# EasyEDA Pro project 3_circuito logico AND.eprj

# Schematic Schematic1

## Sheets
1 P1: Board Name: Board1; Create Date: 2025-03-28; Page Name: P1; Project Name: 3_circuito logico AND; Schematic Name: Schematic1; Update Date: 2025-03-28
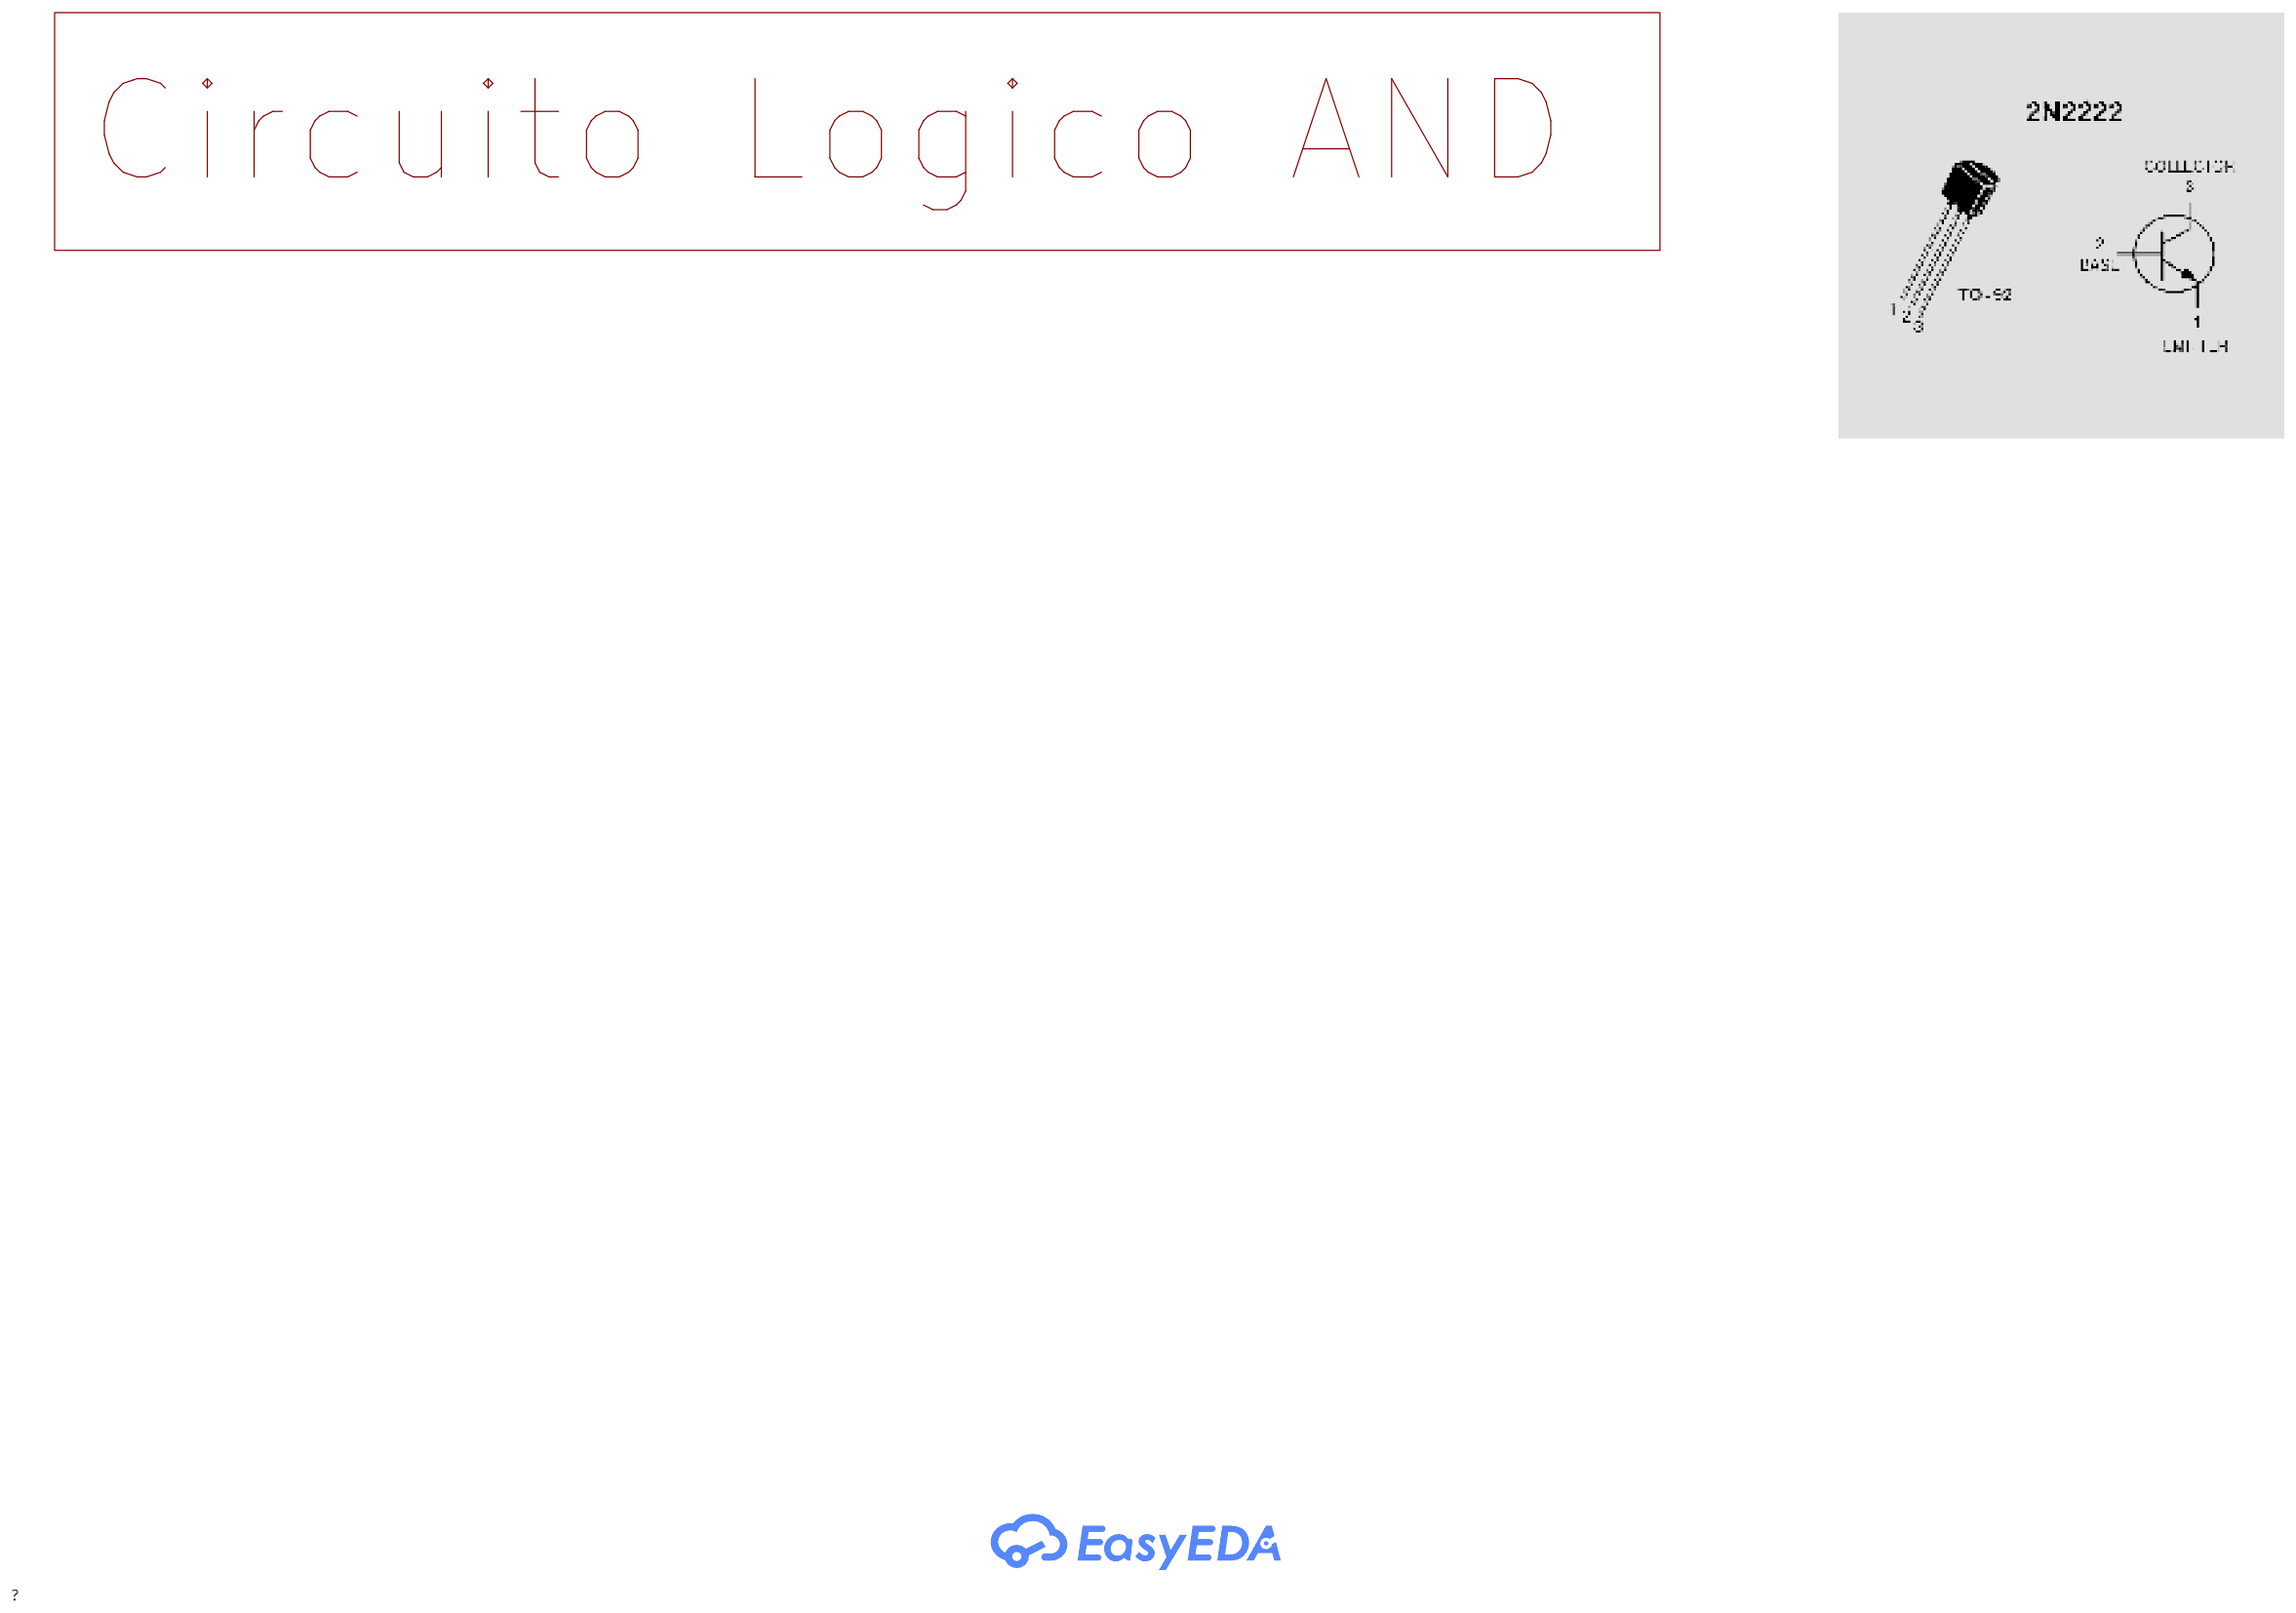
[diagram p0: P1]
2 P2: Page Name: P2
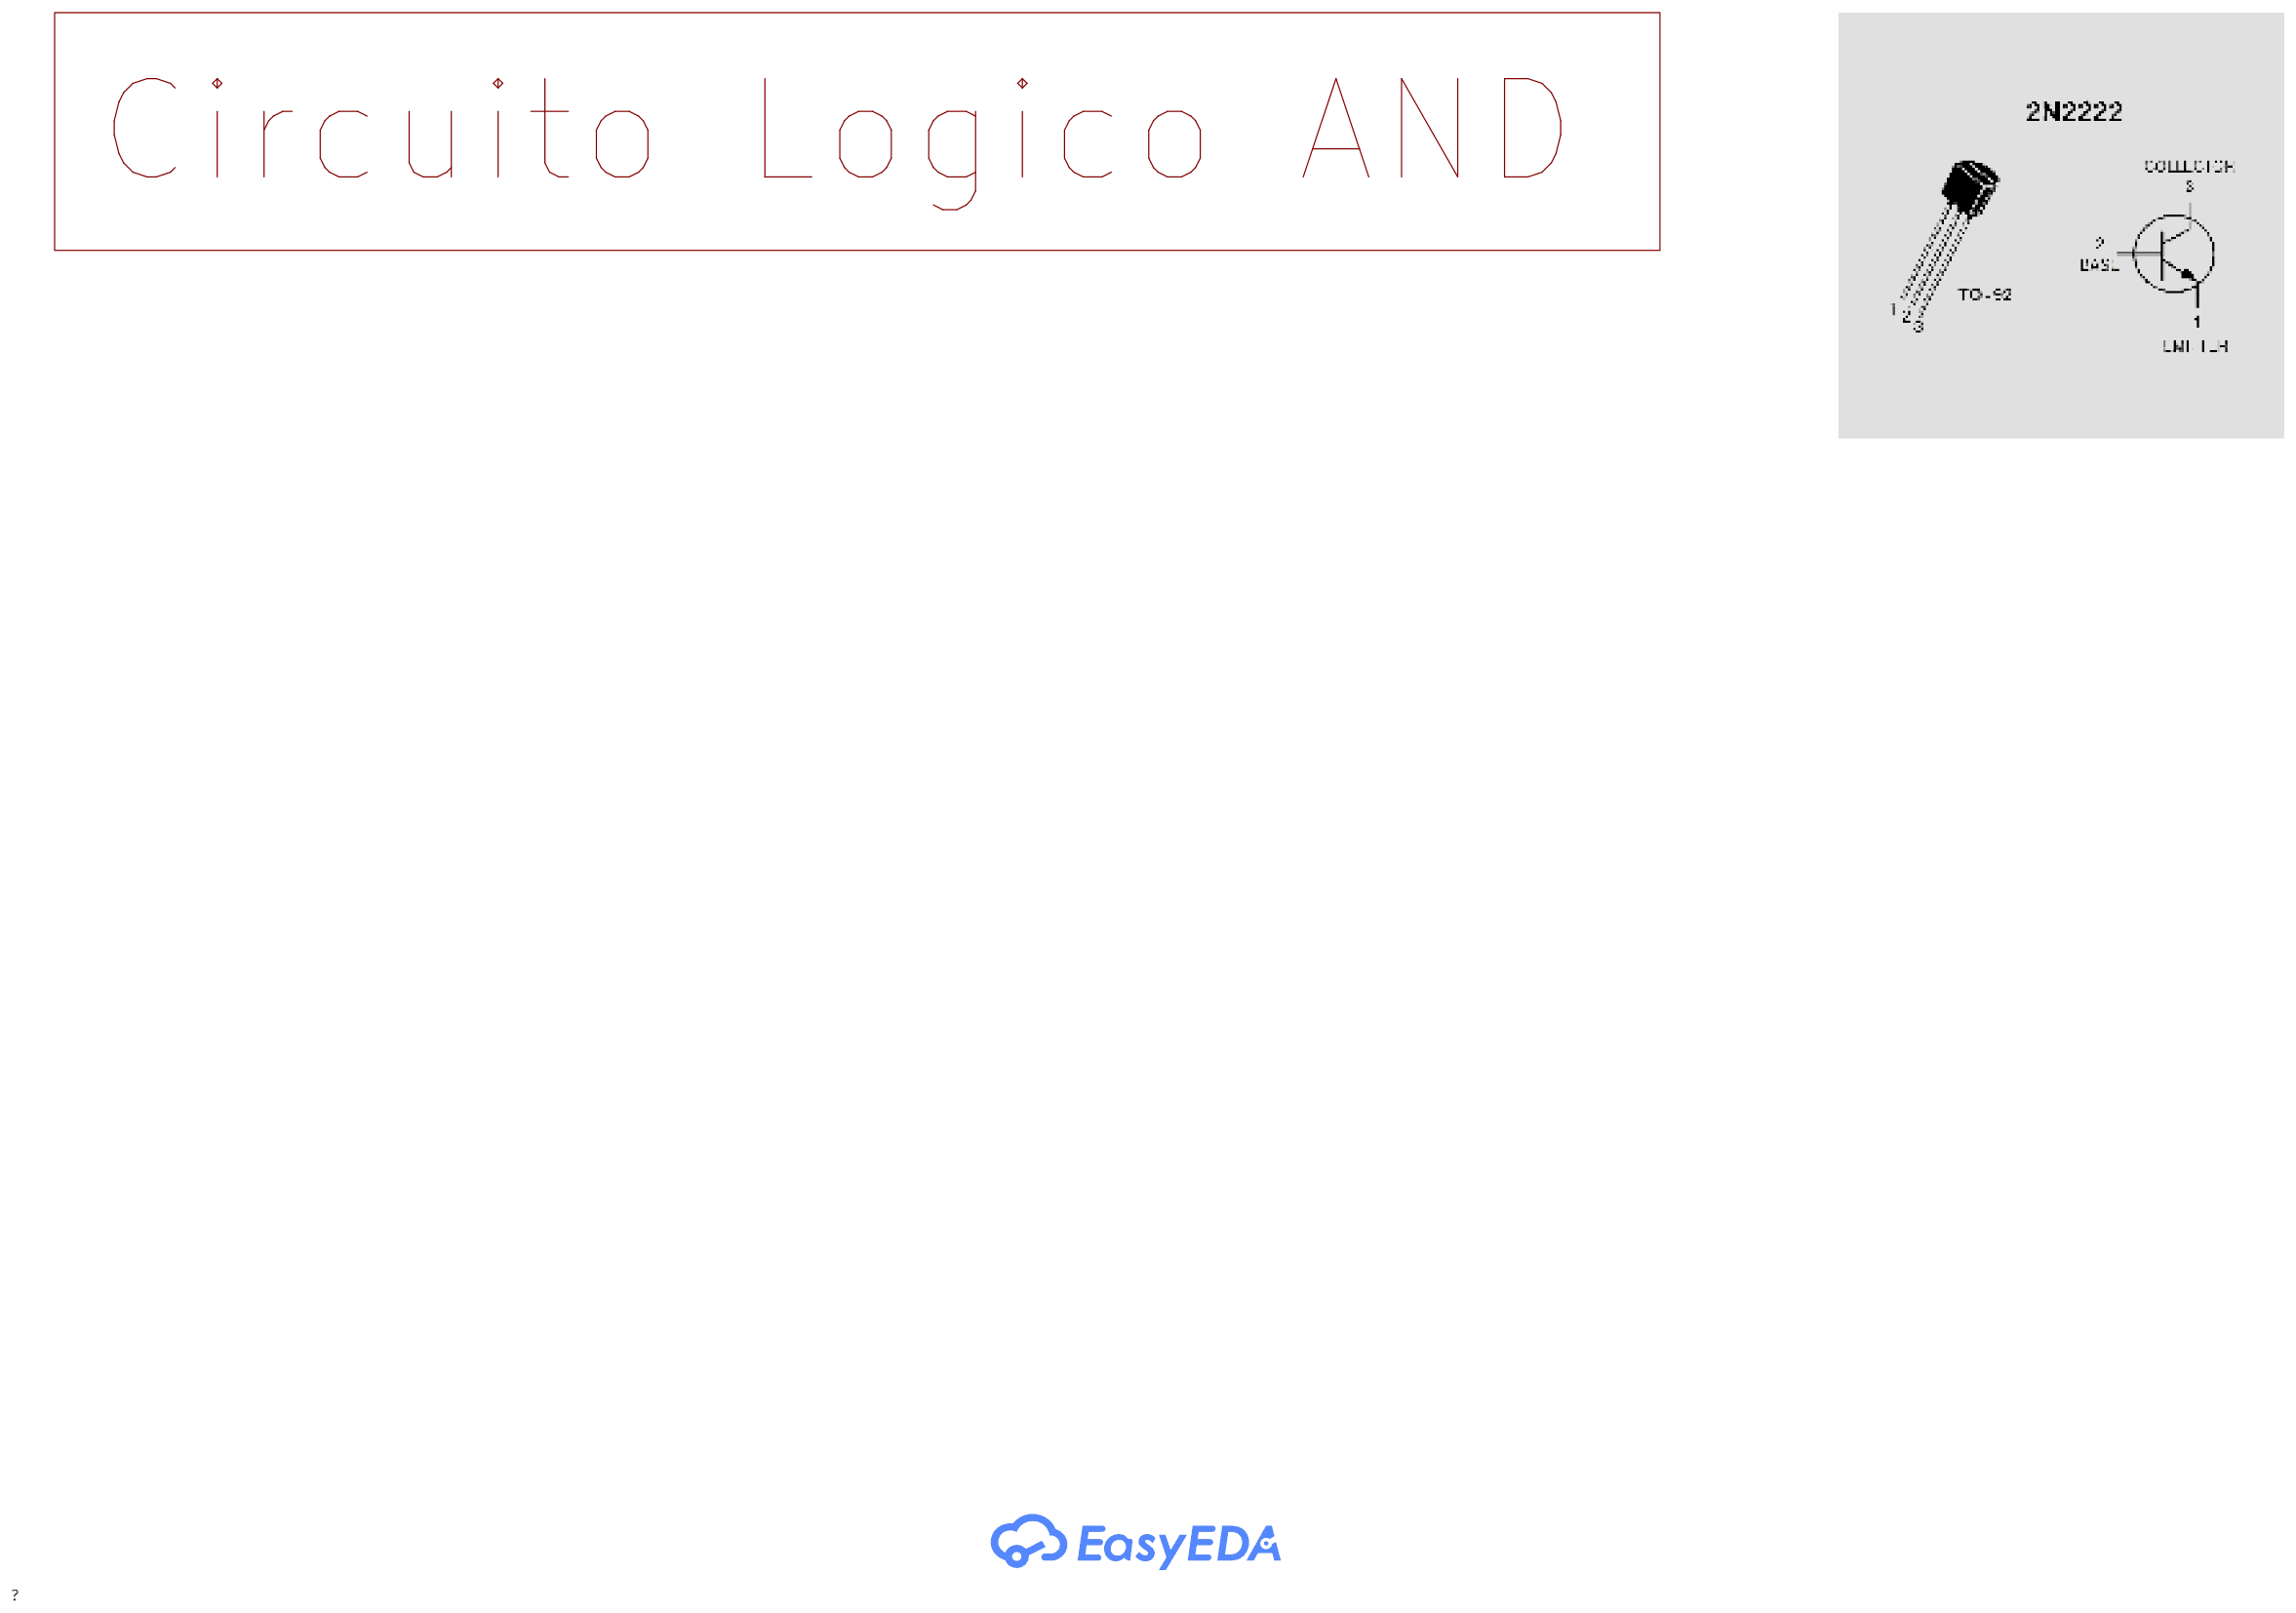
[diagram p1: P2]
3 P3: Page Name: P3
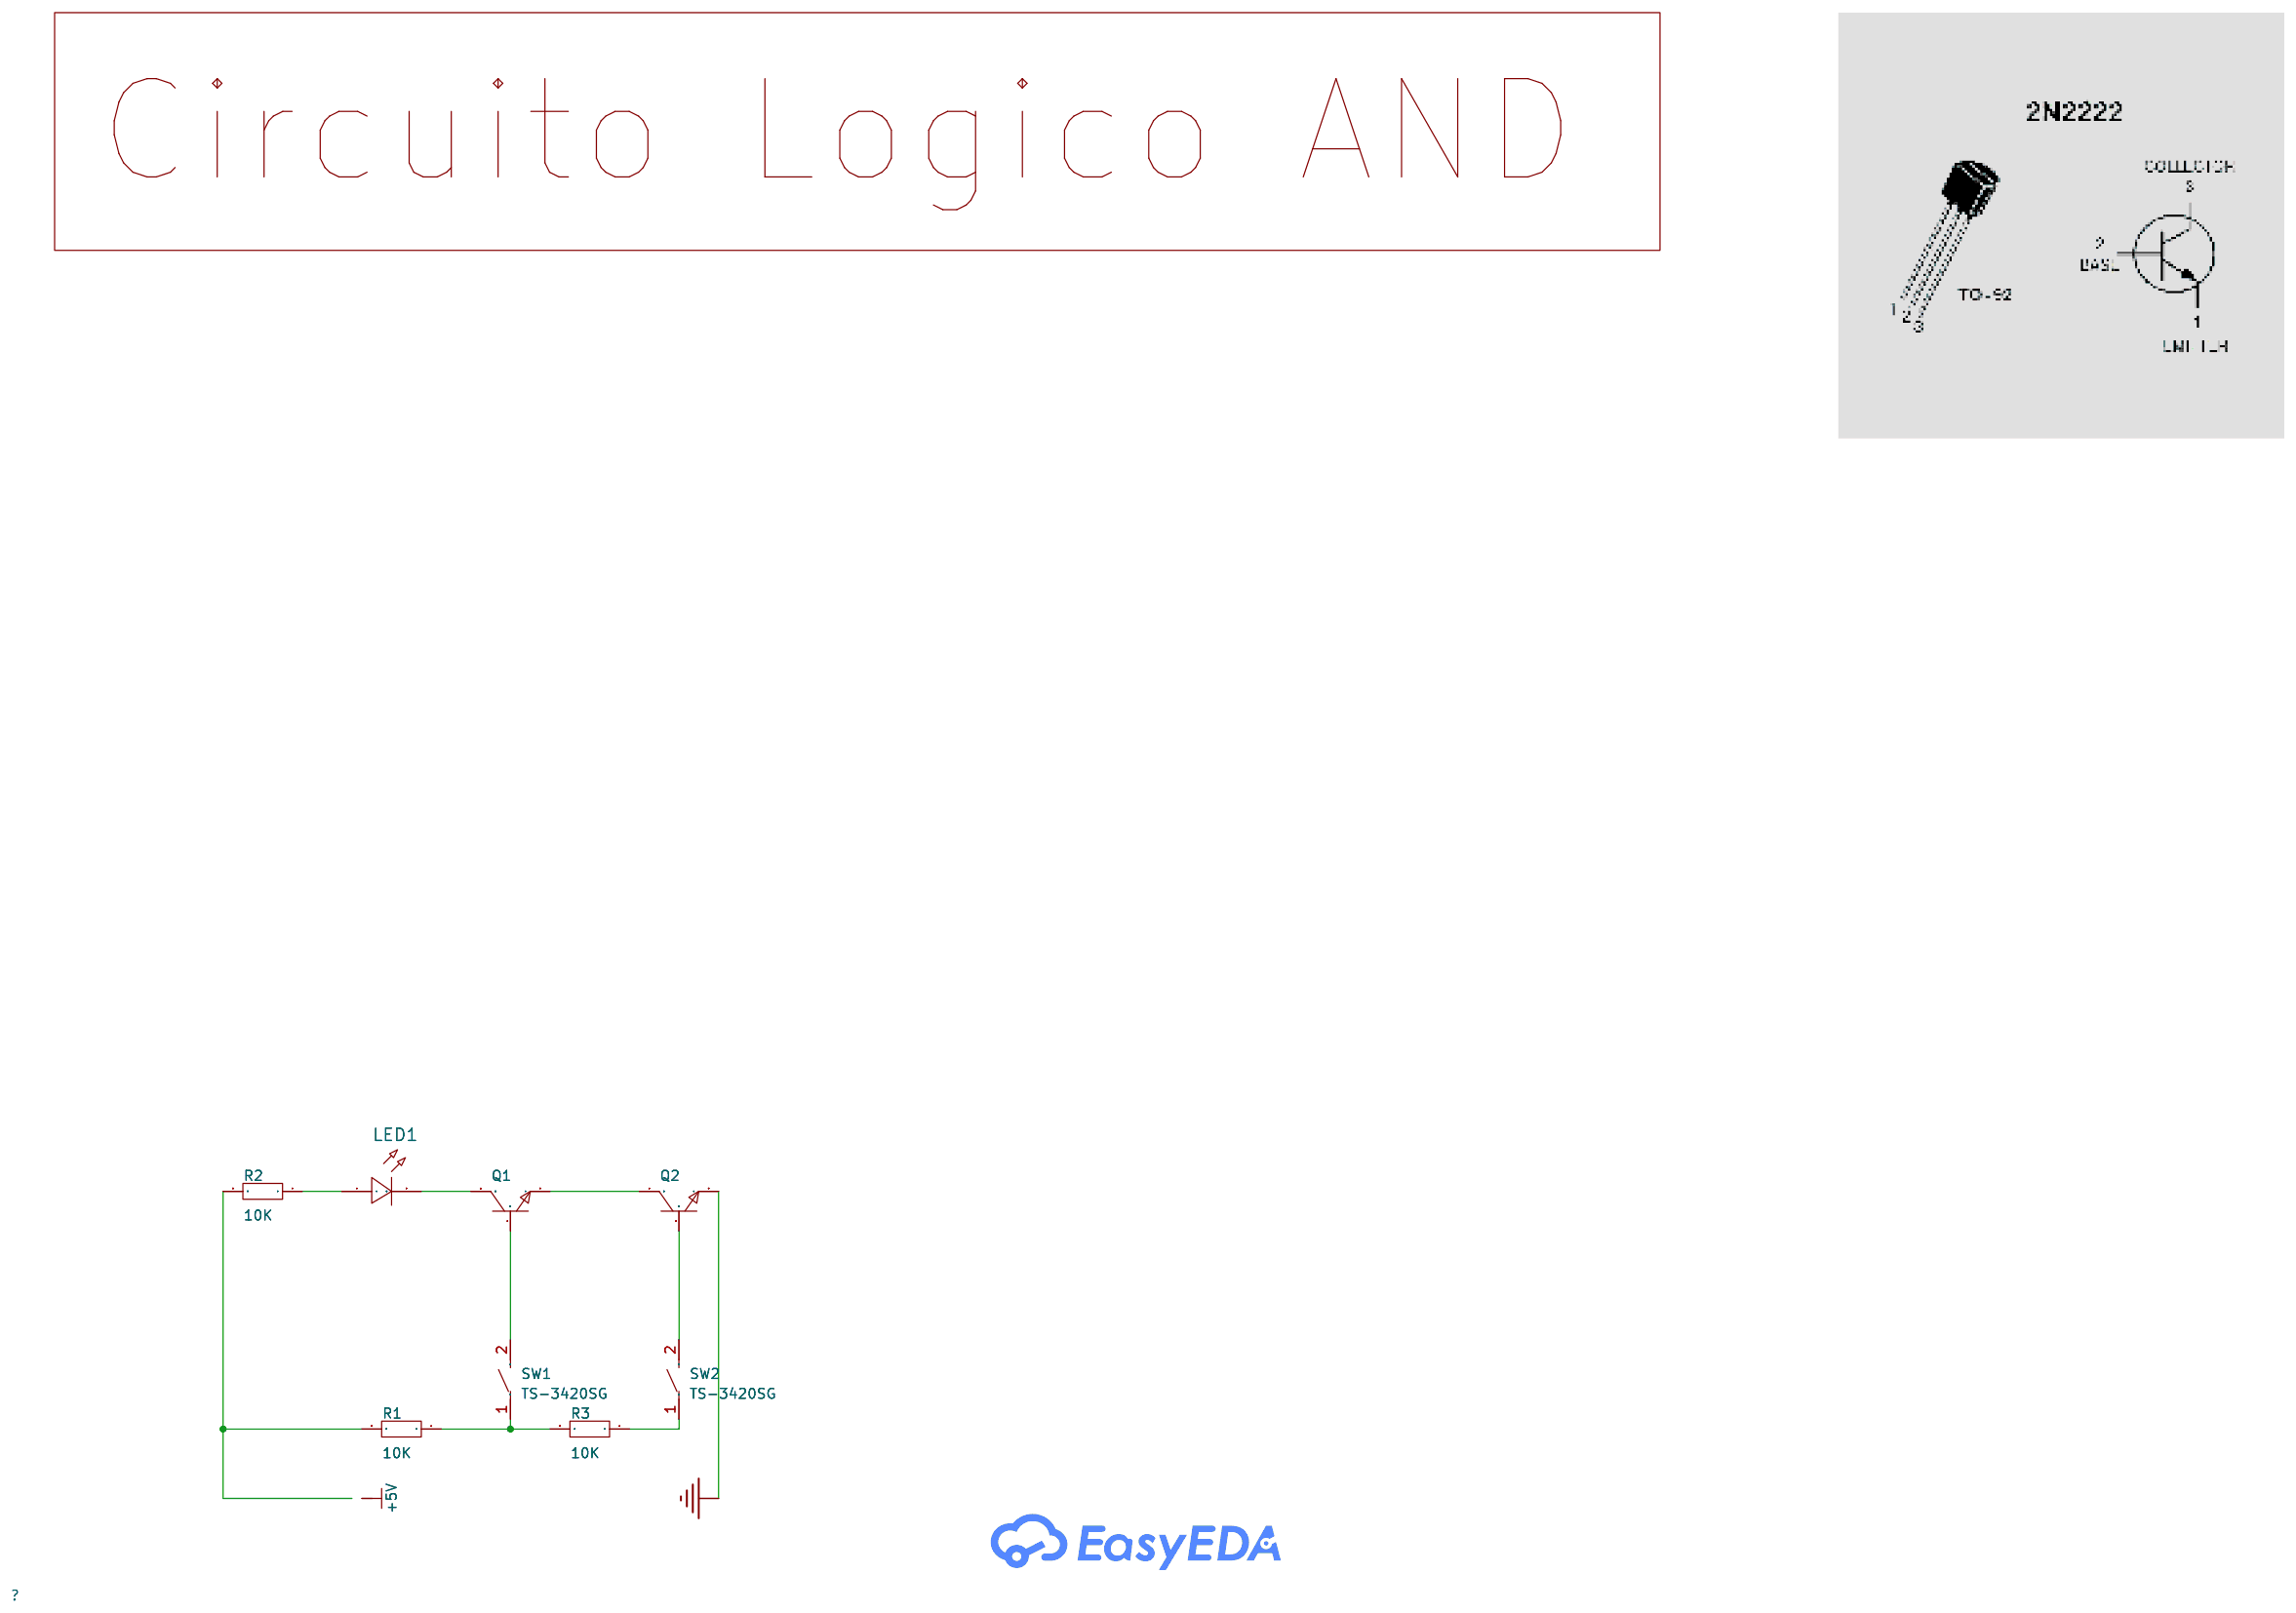
[diagram p2: P3]
4 P4: Page Name: P4
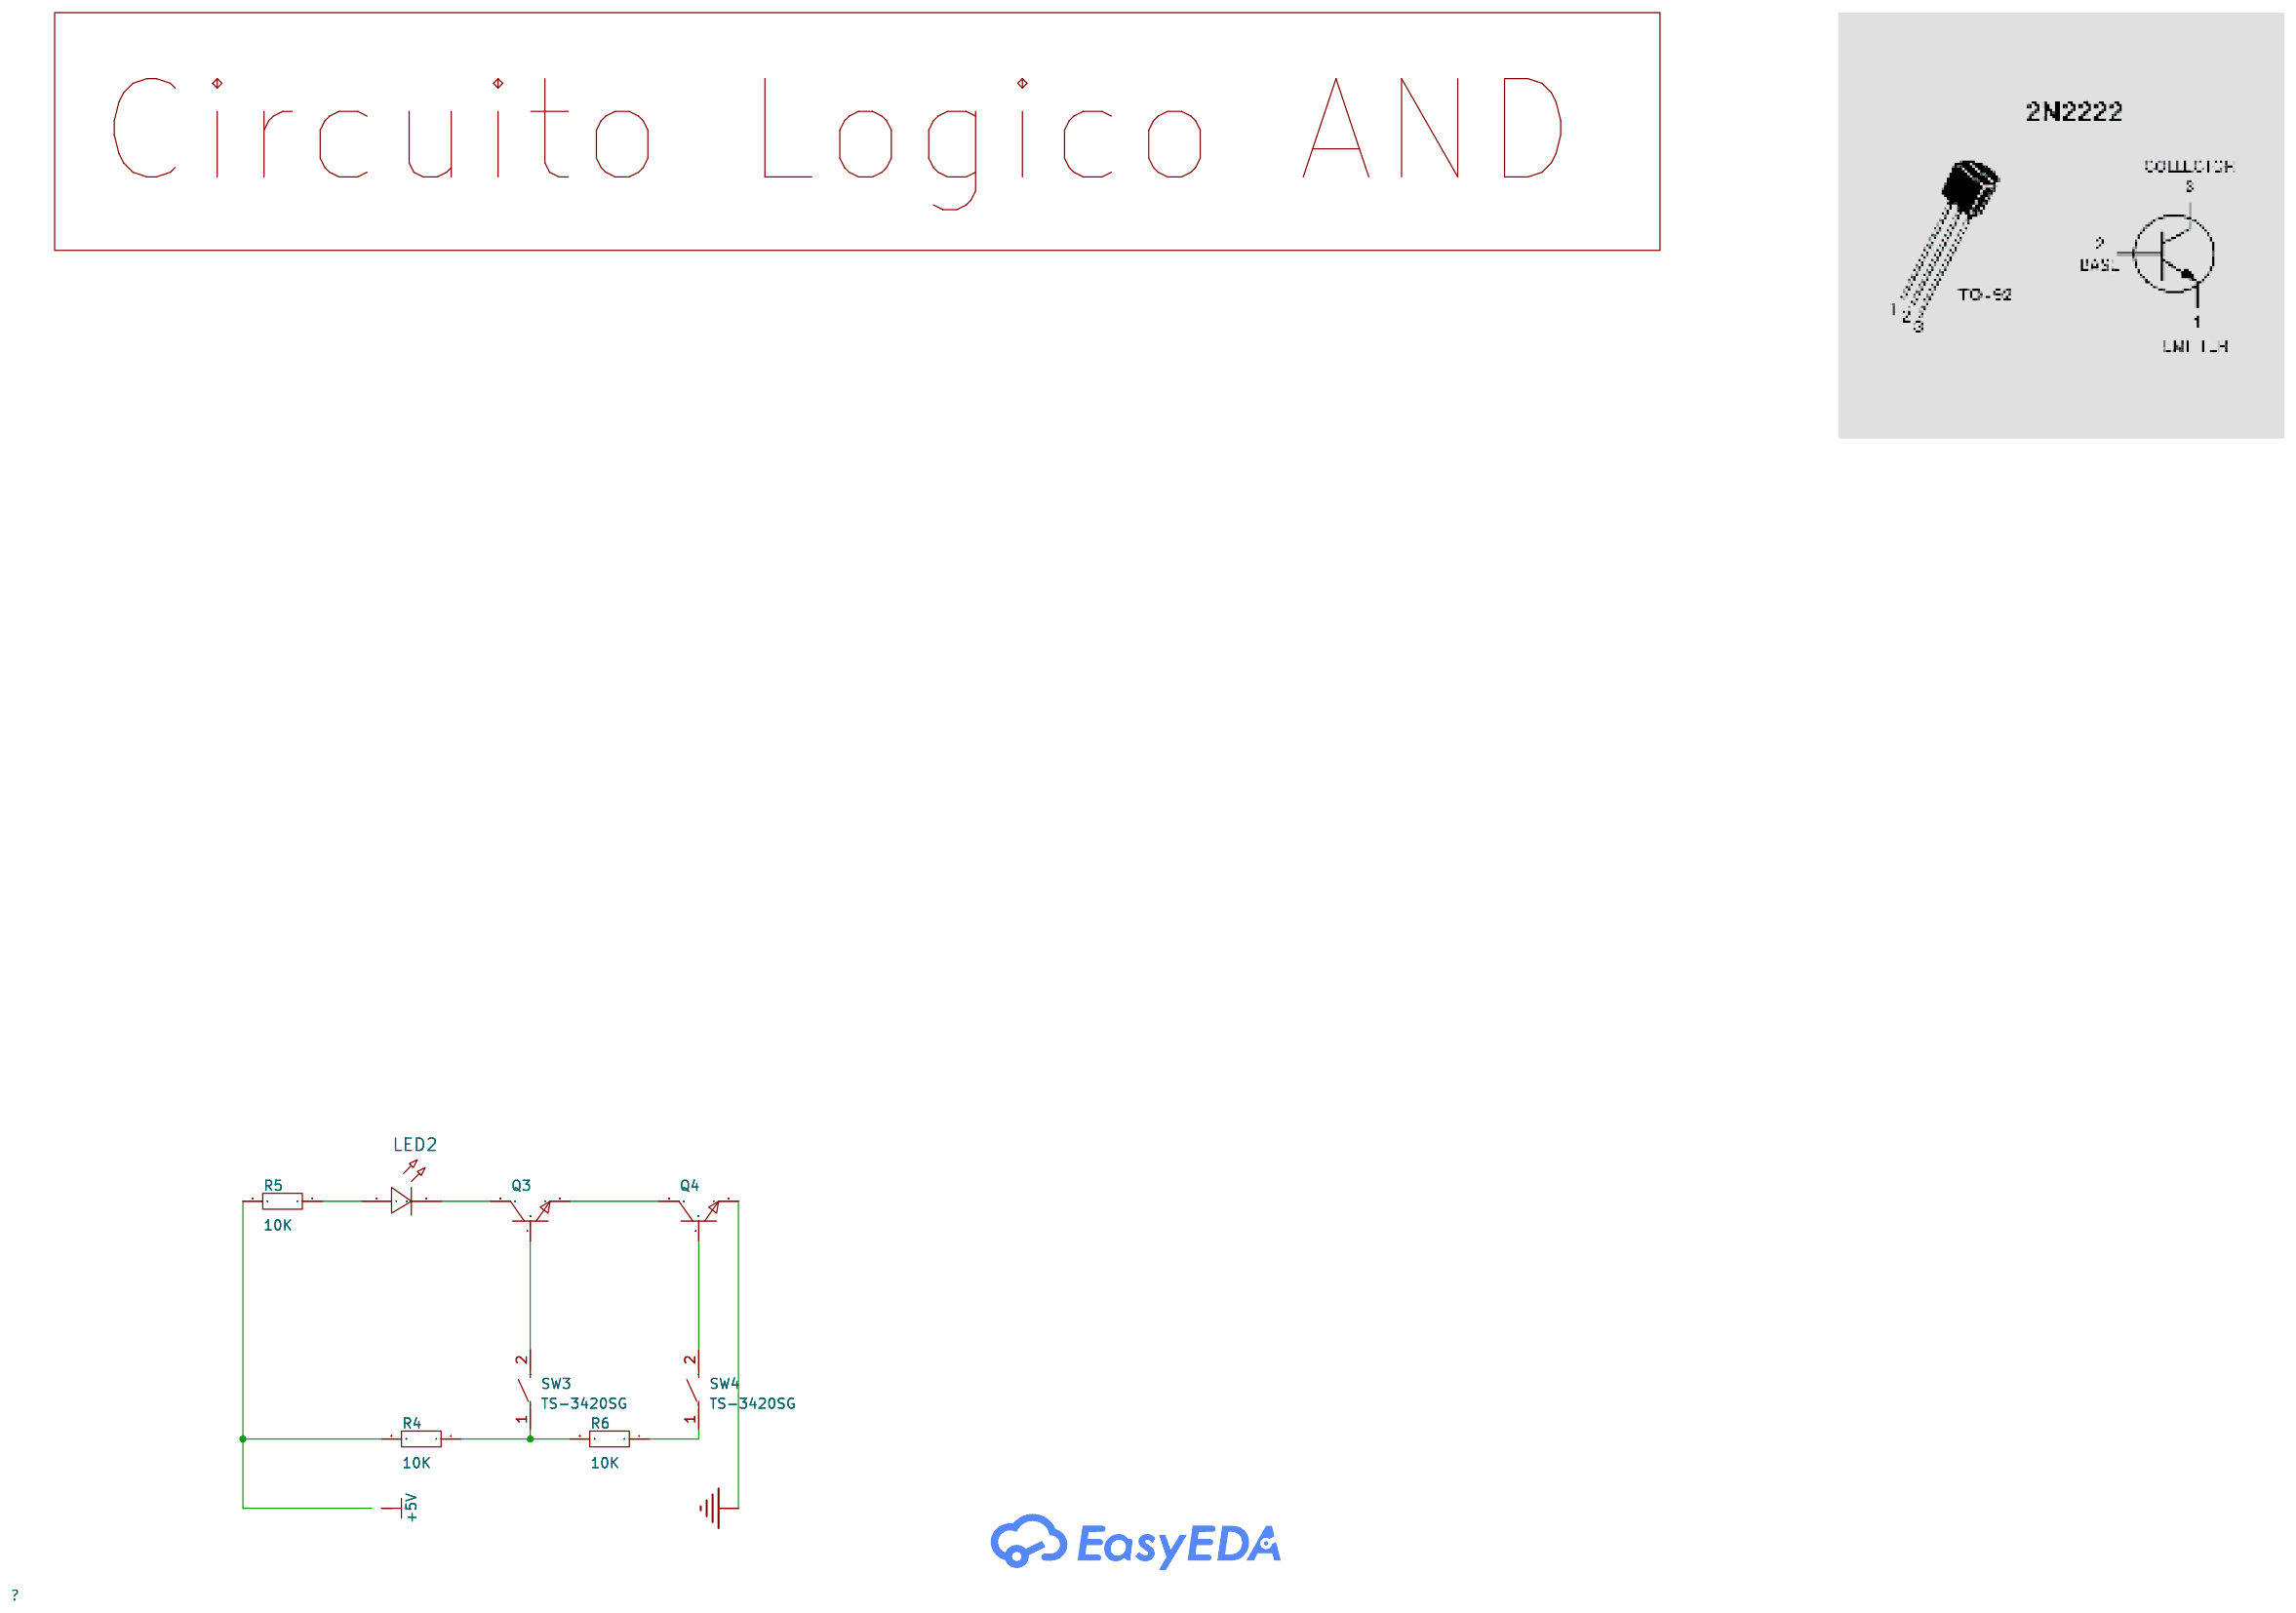
[diagram p3: P4]
5 P7: Page Name: P7
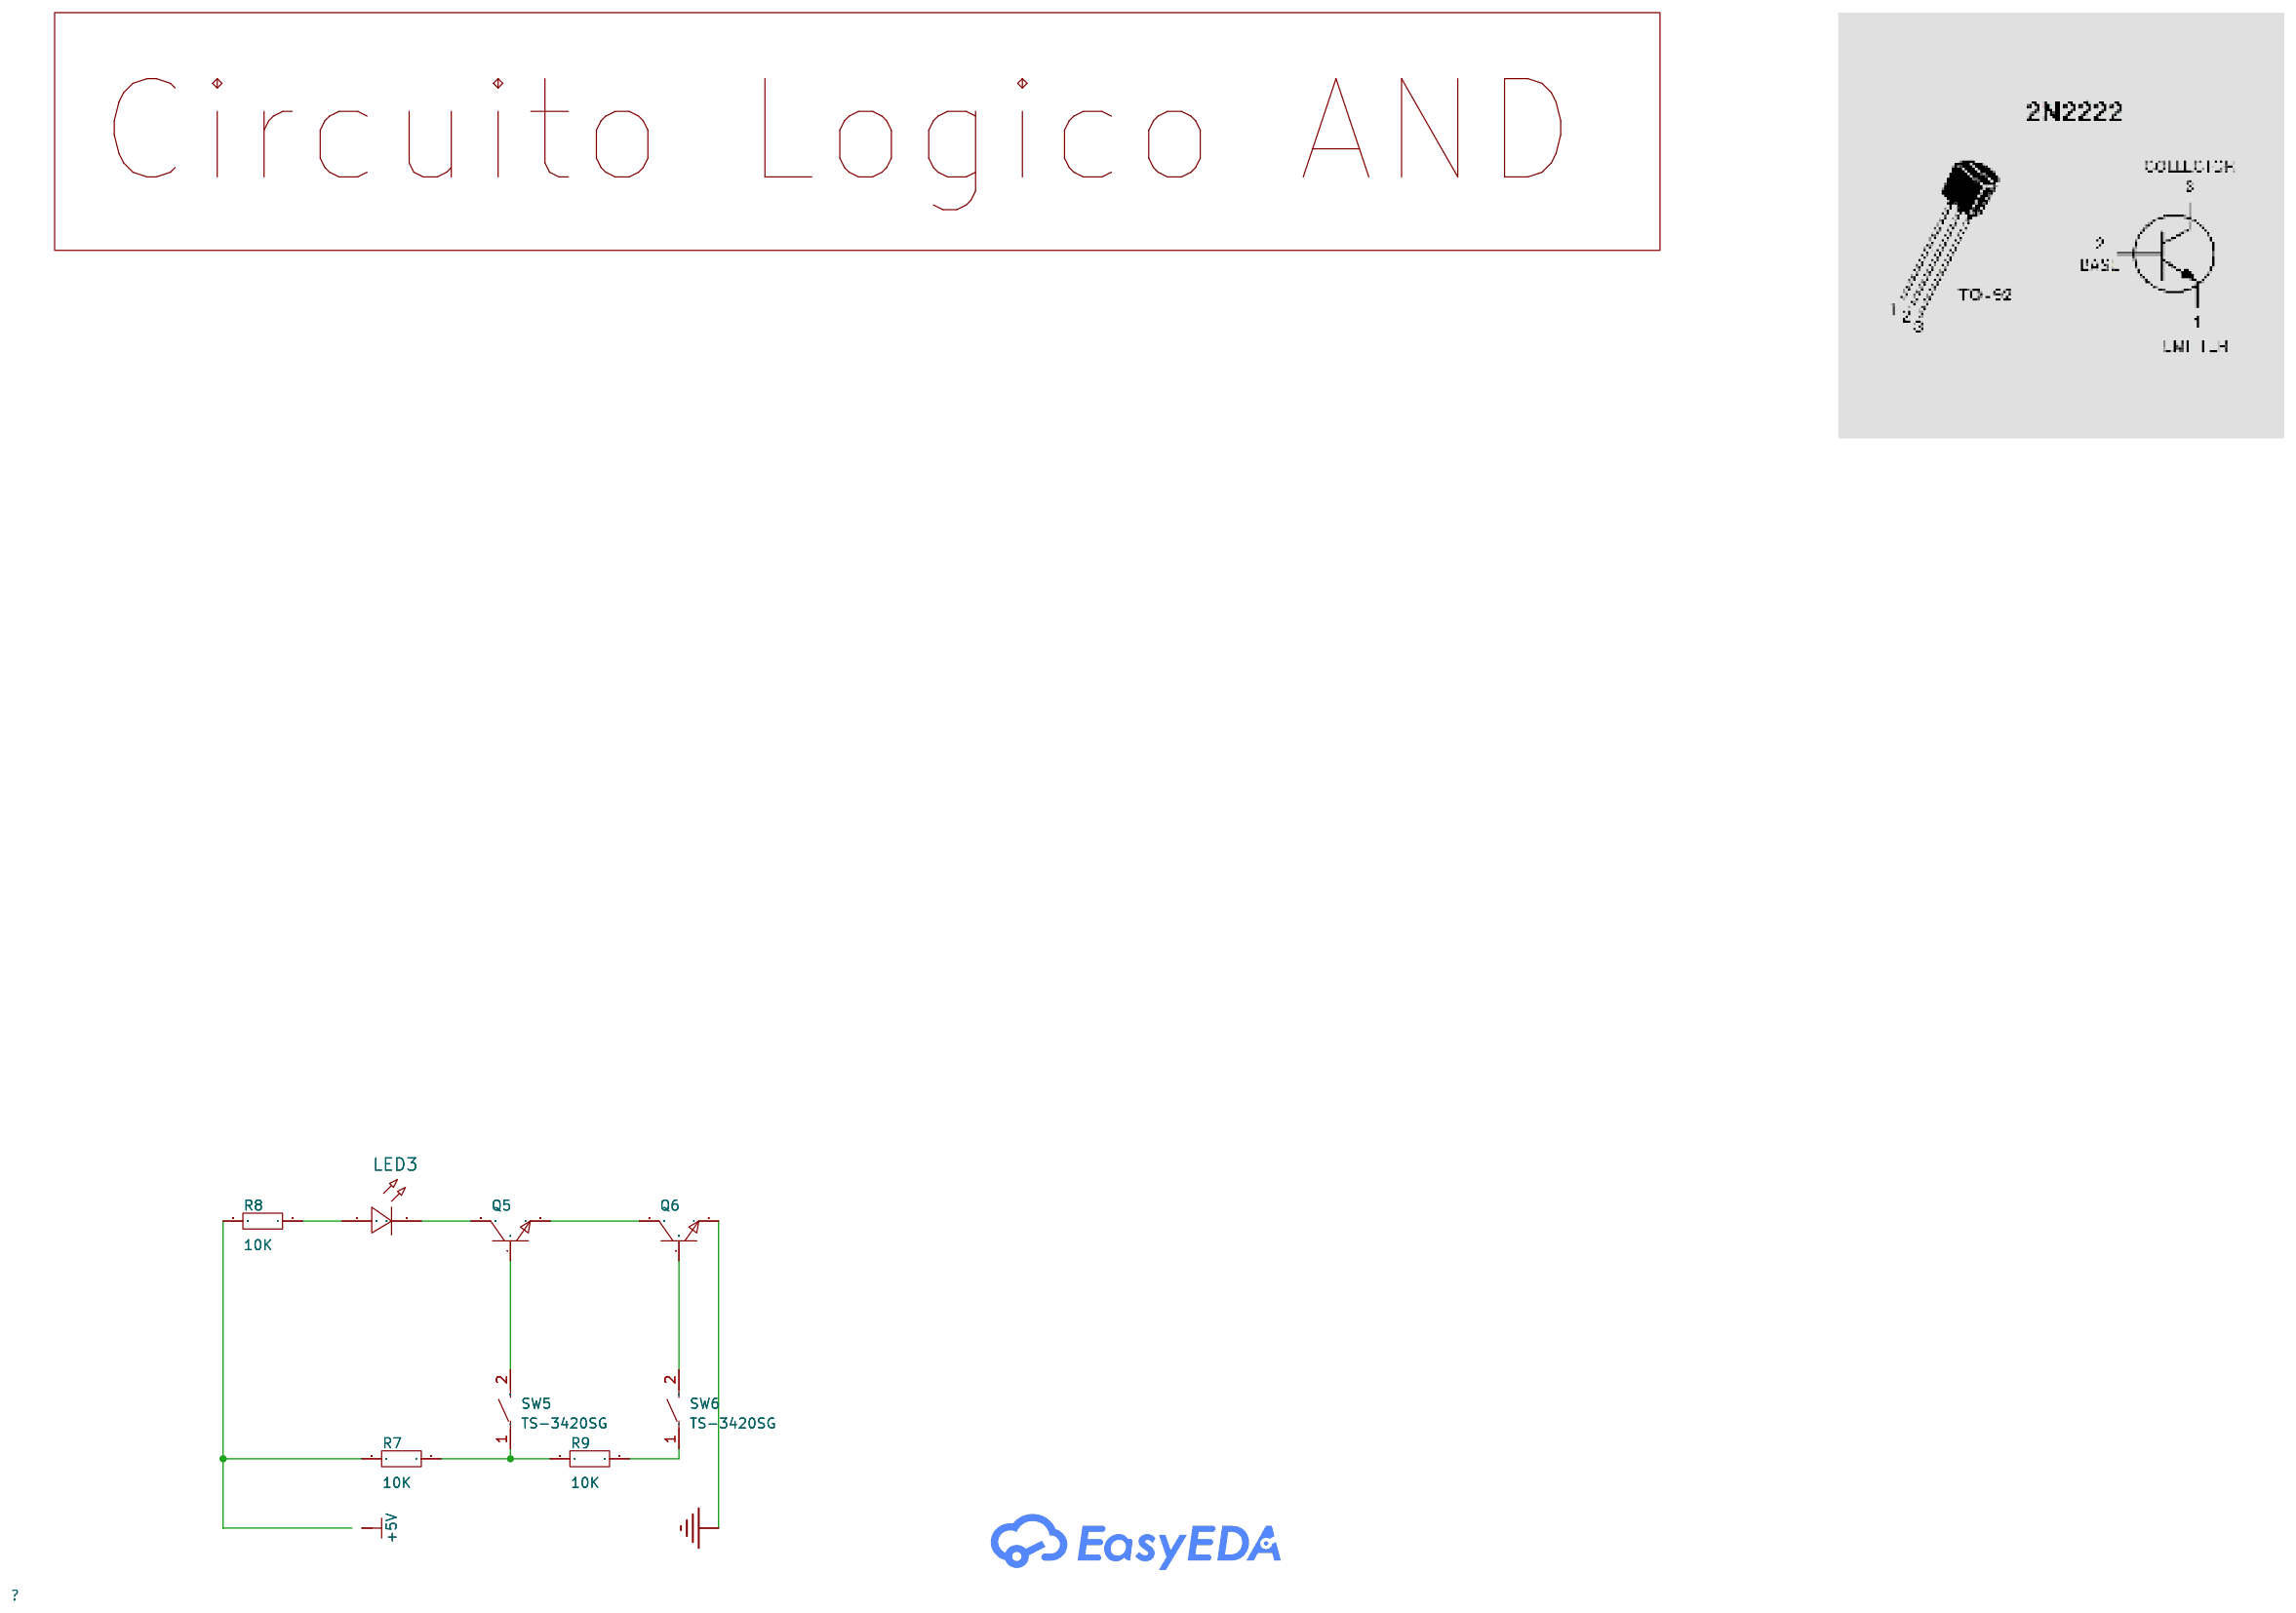
[diagram p4: P7]
6 P8: Page Name: P8
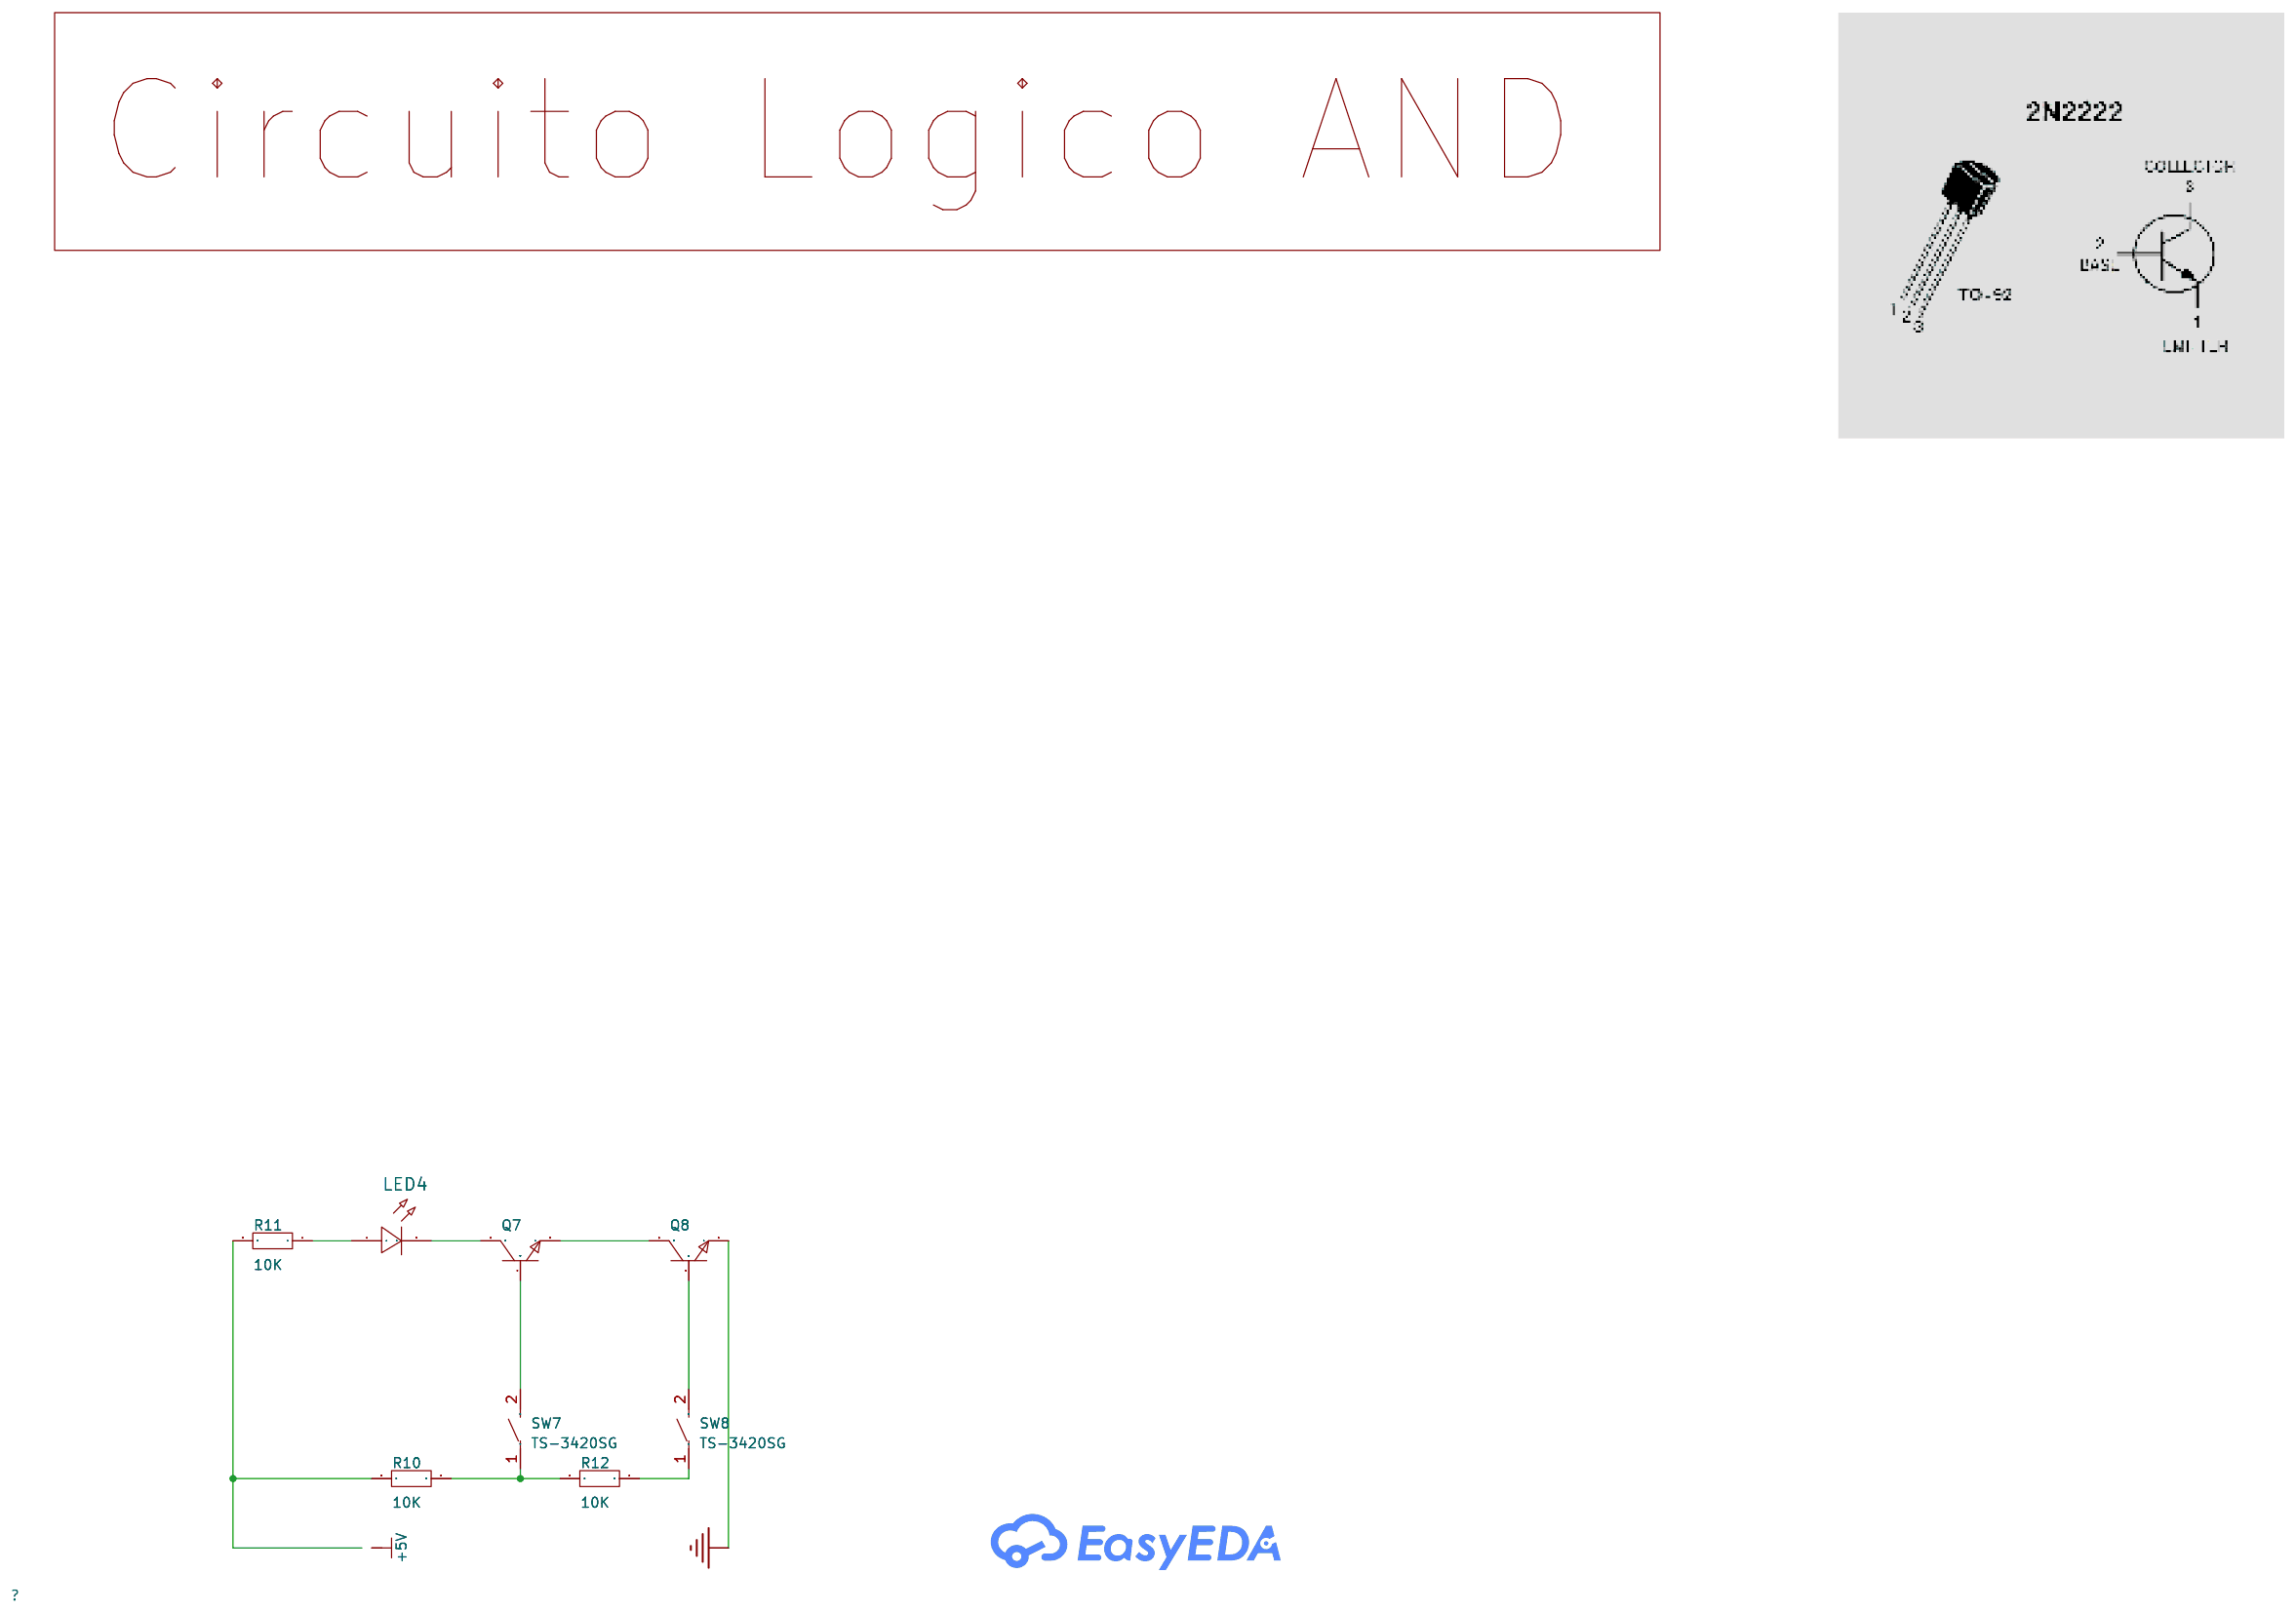
[diagram p5: P8]

## Parts
sheet P3
LED1  -  [LED0402-RD_YELLOW]
Q1  -  [TO-92-3_L4.9-W3.7-P1.27-L]
Q2  -  [TO-92-3_L4.9-W3.7-P1.27-L]
R1  10K  [R0603]
R2  10K  [R0603]
R3  10K  [R0603]
SW1  TS-3420SG  [SW-SMD_TS-3420SG]
SW2  TS-3420SG  [SW-SMD_TS-3420SG]
sheet P4
LED2  -  [LED0402-RD_YELLOW]
Q3  -  [TO-92-3_L4.9-W3.7-P1.27-L]
Q4  -  [TO-92-3_L4.9-W3.7-P1.27-L]
R4  10K  [R0603]
R5  10K  [R0603]
R6  10K  [R0603]
SW3  TS-3420SG  [SW-SMD_TS-3420SG]
SW4  TS-3420SG  [SW-SMD_TS-3420SG]
sheet P7
LED3  -  [LED0402-RD_YELLOW]
Q5  -  [TO-92-3_L4.9-W3.7-P1.27-L]
Q6  -  [TO-92-3_L4.9-W3.7-P1.27-L]
R7  10K  [R0603]
R8  10K  [R0603]
R9  10K  [R0603]
SW5  TS-3420SG  [SW-SMD_TS-3420SG]
SW6  TS-3420SG  [SW-SMD_TS-3420SG]
sheet P8
LED4  -  [LED0402-RD_YELLOW]
Q7  -  [TO-92-3_L4.9-W3.7-P1.27-L]
Q8  -  [TO-92-3_L4.9-W3.7-P1.27-L]
R10  10K  [R0603]
R11  10K  [R0603]
R12  10K  [R0603]
SW7  TS-3420SG  [SW-SMD_TS-3420SG]
SW8  TS-3420SG  [SW-SMD_TS-3420SG]

## Library data of the parts
LED1-LED4 = LED_0402-R: Supplier Footprint: 0402
Q1-Q8 = S8050_NPN: Supplier Footprint: TO-92
R1-R12 = Res_0603: Supplier Footprint: 0603
SW1-SW8 = TS-3420SG: LCSC Part Name: 3*4*2mm 二脚小龟 轻触开关 黑圆键 弹力250gf 编带; Supplier Part: C19779115; Manufacturer: 康深; Supplier Footprint: SMD,3.9x2.5mm; JLCPCB Part Class: Extended Part; Datasheet: https://atta.szlcsc.com/upload/public/pdf/source/20231226/B2DC8EDDC77954C7935DE5F3966C6317.pdf; Supplier: LCSC; Operating Force: 250gf; Length: 4mm; Width: 3mm; Switch Height: 2mm; Actuator/Cap Color: Black; Life: 50,000 times

## Nets
GND: Q2.2(E) Q4.2(E) Q6.2(E) Q8.2(E)
Net-(LED1-1): LED1.1(A) R2.1
Net-(LED1-2): LED1.2(C) Q1.3(C)
Net-(LED2-1): LED2.1(A) R5.1
Net-(LED2-2): LED2.2(C) Q3.3(C)
Net-(LED3-1): LED3.1(A) R8.1
Net-(LED3-2): LED3.2(C) Q5.3(C)
Net-(LED4-1): LED4.1(A) R11.1
Net-(LED4-2): LED4.2(C) Q7.3(C)
Net-(Q1-1): Q1.1(B) SW1.2
Net-(Q1-2): Q1.2(E) Q2.3(C)
Net-(Q2-1): Q2.1(B) SW2.2
Net-(Q3-1): Q3.1(B) SW3.2
Net-(Q3-2): Q3.2(E) Q4.3(C)
Net-(Q4-1): Q4.1(B) SW4.2
Net-(Q5-1): Q5.1(B) SW5.2
Net-(Q5-2): Q5.2(E) Q6.3(C)
Net-(Q6-1): Q6.1(B) SW6.2
Net-(Q7-1): Q7.1(B) SW7.2
Net-(Q7-2): Q7.2(E) Q8.3(C)
Net-(Q8-1): Q8.1(B) SW8.2
Net-(R1-1): R1.1 R3.2 SW1.1
Net-(R1-2): R1.2 R2.2
Net-(R3-1): R3.1 SW2.1
Net-(R4-1): R4.1 R6.2 SW3.1
Net-(R4-2): R4.2 R5.2
Net-(R6-1): R6.1 SW4.1
Net-(R7-1): R7.1 R9.2 SW5.1
Net-(R7-2): R7.2 R8.2
Net-(R9-1): R9.1 SW6.1
Net-(R10-1): R10.1 R12.2 SW7.1
Net-(R10-2): R10.2 R11.2
Net-(R12-1): R12.1 SW8.1
